# EAGLE design SKAARDUINO_v3.1_back (EAGLE 7.5.0)

## Sheet 1 of 2
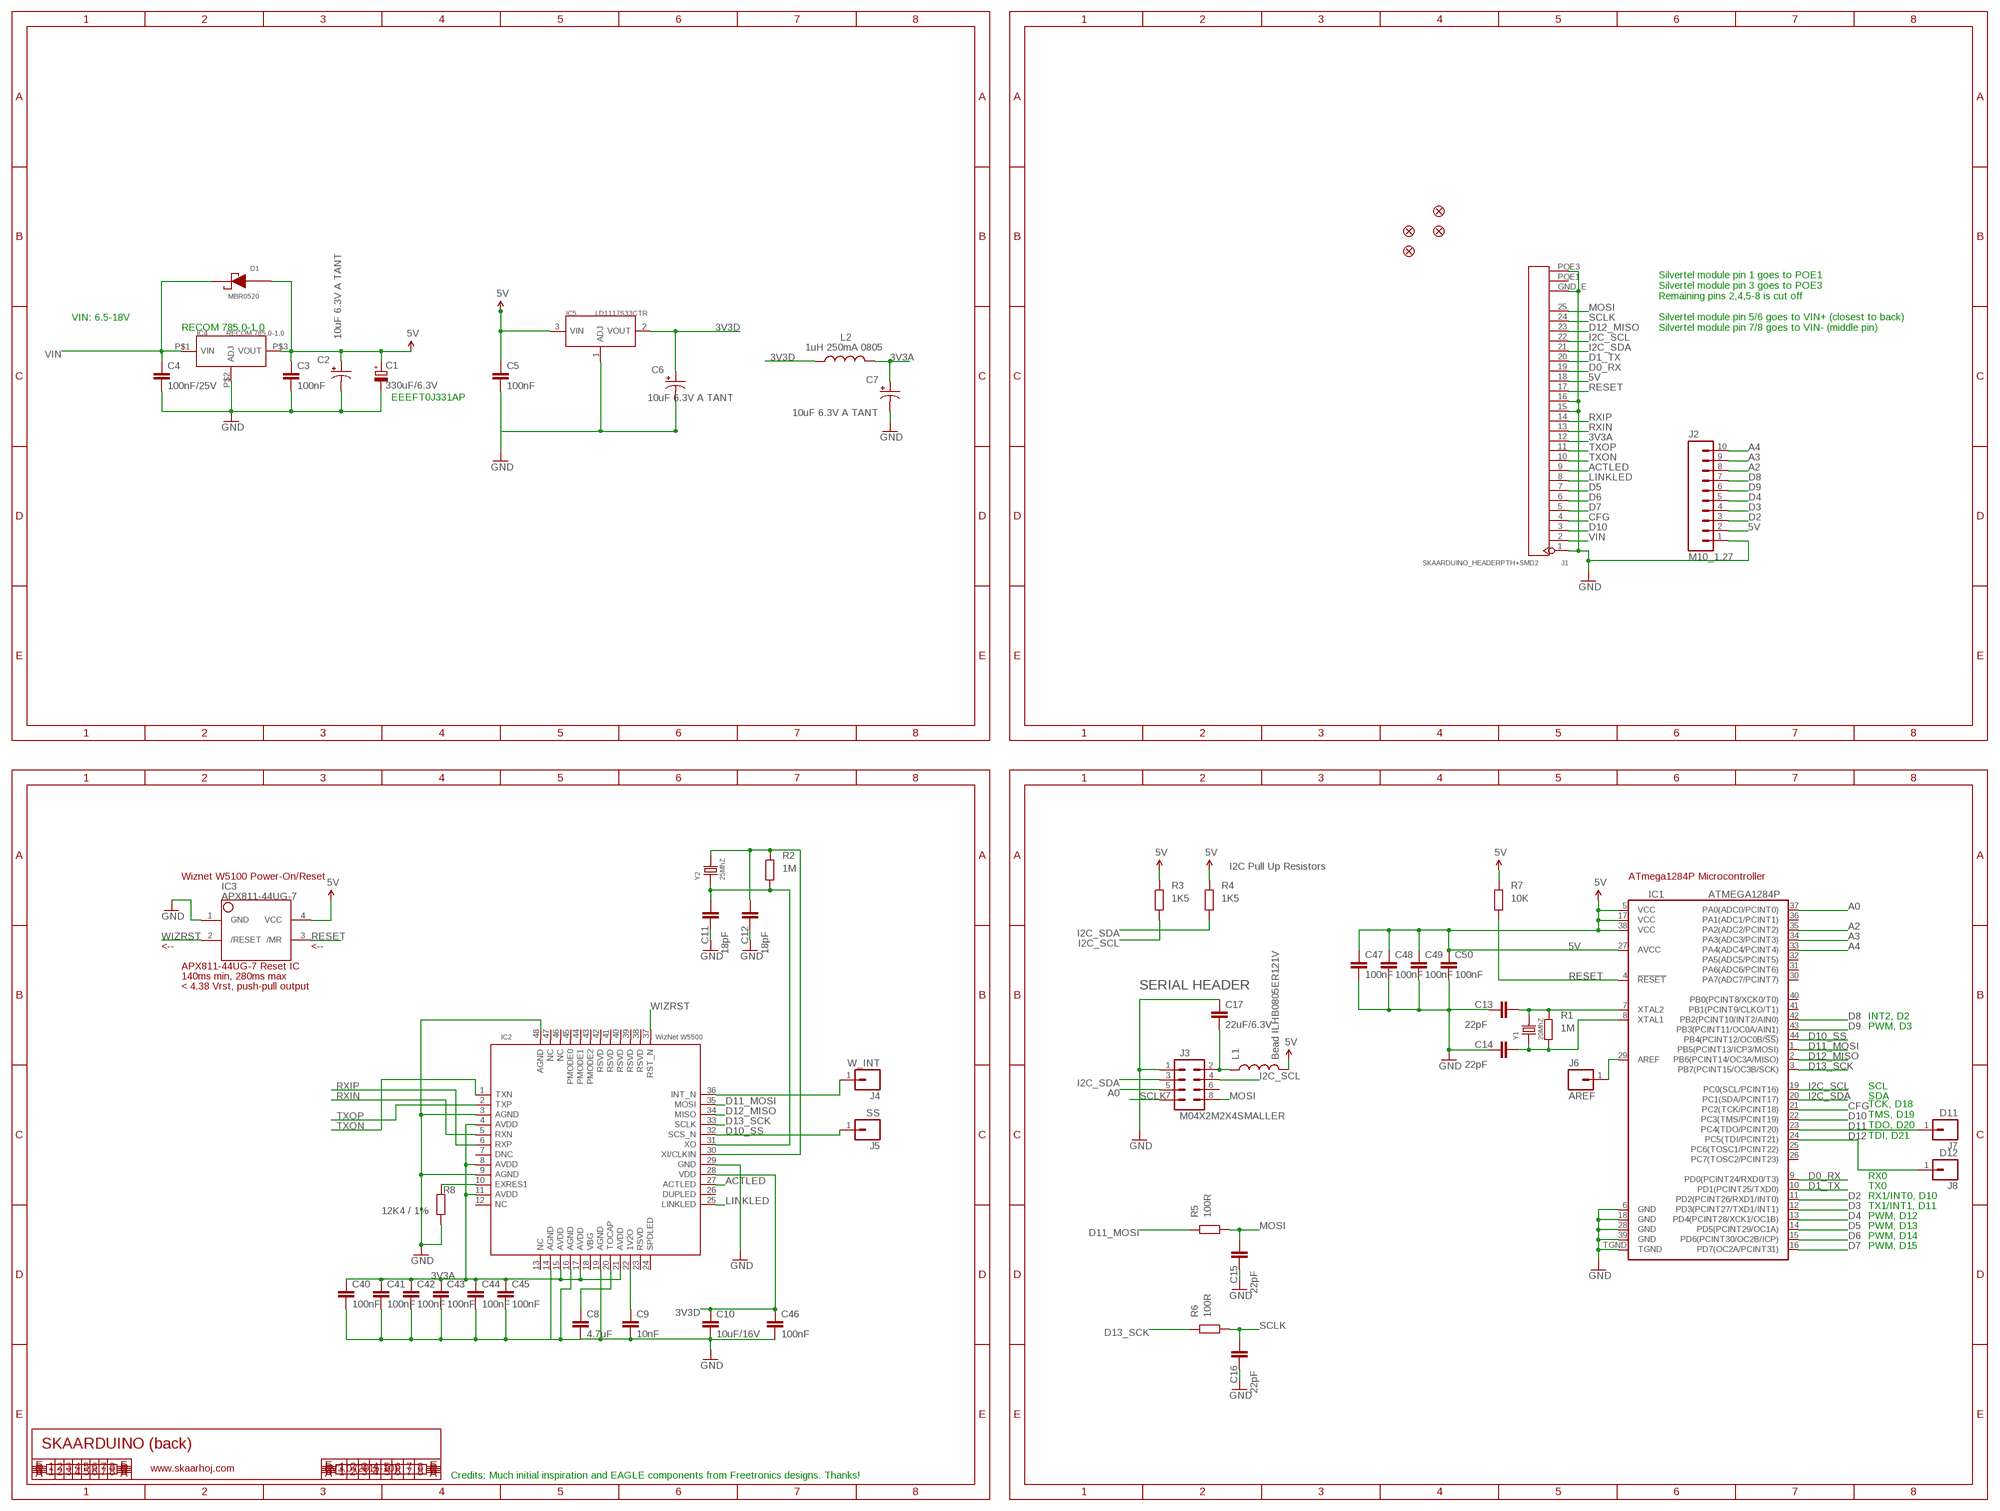
[diagram p0: schematic, sheet 1]

### Parts
C1  330uF/6.3V  CPOL-EUD  [PANASONIC_D]
C2  10uF 6.3V A TANT  CAP_POL1206  [EIA3216]
C3  100nF  C-EU0402C  [0402C]
C4  100nF/25V  C-EU0402C  [0402C]
C5  100nF  C-EU0402C  [0402C]
C6  10uF 6.3V A TANT  CAP_POL1206  [EIA3216]
C7  10uF 6.3V A TANT  CAP_POL1206  [EIA3216]
C8  4.7uF  CAP0805  [0805]
C9  10nF  C-EU0402C  [0402C]
C10  10uF/16V  CAP0805  [0805]
C11  18pF  C-EU0402C  [0402C]
C12  18pF  C-EU0402C  [0402C]
C13  22pF  C-EU0402C  [0402C]
C14  22pF  C-EU0402C  [0402C]
C15  22pF  C-EU0402C  [0402C]
C16  22pF  C-EU0402C  [0402C]
C17  22uF/6.3V  CAP0805  [0805]
C40  100nF  C-EU0402C  [0402C]
C41  100nF  C-EU0402C  [0402C]
C42  100nF  C-EU0402C  [0402C]
C43  100nF  C-EU0402C  [0402C]
C44  100nF  C-EU0402C  [0402C]
C45  100nF  C-EU0402C  [0402C]
C46  100nF  C-EU0402C  [0402C]
C47  100nF  C-EU0402C  [0402C]
C48  100nF  C-EU0402C  [0402C]
C49  100nF  C-EU0402C  [0402C]
C50  100nF  C-EU0402C  [0402C]
D1  MBR0520  [SOD-123]
FID1  FIDUCIAL1X2.5  [FIDUCIAL-1X2.5]
FID2  FIDUCIAL1X2.5  [FIDUCIAL-1X2.5]
FID3  FIDUCIAL1X2.5  [FIDUCIAL-1X2.5]
FID4  FIDUCIAL1X2.5  [FIDUCIAL-1X2.5]
IC1  ATMEGA1284P  [QFN-44M1]
IC2  WizNet W5500  DRIVER-W5500  [LQFP-48]
IC3  APX811-44UG-7  APX81X-RESET-IC  [SOT143-R]
IC4  RECOM 785.0-1.0  PMIC-LM317EMP  [RECOM_785.0-1.0]
IC5  LD1117S33CTR  PMIC-LM317EMPUPRIGHT  [SOT-223-UPRIGHT]
J1  SKAARDUINO_HEADERPTH+SMD2  [SKAARDUINO_PTH_SMD2_HEADER]
J2  M10_1.27  [M10X1]
J3  M04X2M2X4SMALLER  [M2X4SMALLER]
J4  W_INT  M1X1TEST  [M1X1]
J5  SS  M1X1TEST  [M1X1]
J6  AREF  M1X1TEST  [M1X1]
J7  D11  M1X1TEST  [M1X1]
J8  D12  M1X1TEST  [M1X1]
L1  Bead ILHB0805ER121V  INDUCTOR0805  [0805]
L2  1uH 250mA 0805  L-USL2012C  [L2012C]
R1  1M  RESISTOR0402  [0402]
R2  1M  RESISTOR0402  [0402]
R3  1K5  RESISTOR0402  [0402]
R4  1K5  RESISTOR0402  [0402]
R5  100R  RESISTOR0402  [0402]
R6  100R  RESISTOR0402  [0402]
R7  10K  RESISTOR0402  [0402]
R8  12K4 / 1%  RESISTOR0402  [0402]
Y1  20MhZ  SMD-CRYSTAL-16MHZ-8PF-20PPM-40R(2P-5.0X3.2MM)  [X2-SMD-5.0X3.2X1.3MM]
Y2  25MhZ  SMD-CRYSTAL-16MHZ-8PF-20PPM-40R(2P-5.0X3.2MM)  [X2-SMD-5.0X3.2X1.3MM]

### Nets
3V3A [power]: C7.A(+) C40.1 C41.1 C42.1 C43.1 C44.1 C45.1 IC2.4(AVDD) IC2.8(AVDD) IC2.11(AVDD) IC2.15(AVDD) IC2.17(AVDD) IC2.21(AVDD) J1.12 L2.2
3V3D [power]: C6.A(+) C10.1 C46.1 IC2.28(VDD) IC5.2(VOUT) L2.1
5V [power]: C1.+ C2.A(+) C3.1 C5.1 C47.1 C48.1 C49.1 C50.1 D1.2(AN) IC1.5(VCC) IC1.17(VCC) IC1.27(AVCC) IC1.38(VCC) IC3.4(VCC) IC4.P$3(VOUT) IC5.3(VIN) J1.18 J2.2 L1.2 R3.2 R4.2 R7.2
A0: IC1.37(PA0(ADC0/PCINT0)) J3.5
A2: IC1.35(PA2(ADC2/PCINT2)) J2.8
A3: IC1.34(PA3(ADC3/PCINT3)) J2.9
A4: IC1.33(PA4(ADC4/PCINT4)) J2.10
ACTLED: IC2.27(ACTLED) J1.9
CFG: IC1.21(PC2(TCK/PCINT18)) J1.4
D0_RX: IC1.9(PD0(PCINT24/RXD0/T3)) J1.19
D1_TX: IC1.10(PD1(PCINT25/TXD0)) J1.20
D2: IC1.11(PD2(PCINT26/RXD1/INT0)) J2.3
D3: IC1.12(PD3(PCINT27/TXD1/INT1)) J2.4
D4: IC1.13(PD4(PCINT28/XCK1/OC1B)) J2.5
D5: IC1.14(PD5(PCINT29/OC1A)) J1.7
D6: IC1.15(PD6(PCINT30/OC2B/ICP)) J1.6
D7: IC1.16(PD7(OC2A/PCINT31)) J1.5
D8: IC1.42(PB2(PCINT10/INT2/AIN0)) J2.7
D9: IC1.43(PB3(PCINT11/OC0A/AIN1)) J2.6
D10: IC1.22(PC3(TMS/PCINT19)) J1.3
D10_SS: IC1.44(PB4(PCINT12/OC0B/!SS!)) IC2.32(SCS_N) J5.1
D11: IC1.23(PC4(TDO/PCINT20)) J7.1
D11_MOSI: IC1.1(PB5(PCINT13/ICP3/MOSI)) IC2.35(MOSI) R5.2
D12: IC1.24(PC5(TDI/PCINT21)) J8.1
D12_MISO: IC1.2(PB6(PCINT14/OC3A/MISO)) IC2.34(MISO) J1.23
D13_SCK: IC1.3(PB7(PCINT15/OC3B/SCK)) IC2.33(SCLK) R6.2
GND [power]: C1.- C2.C(-) C3.2 C4.2 C5.2 C6.C(-) C7.C(-) C8.2 C9.2 C10.2 C11.1 C12.1 C13.1 C14.1 C15.1 C16.1 C17.1 C40.2 C41.2 C42.2 C43.2 C44.2 C45.2 C46.2 C47.2 C48.2 C49.2 C50.2 IC1.6(GND) IC1.18(GND) IC1.28(GND) IC1.39(GND) IC1.TGND IC2.3(AGND) IC2.9(AGND) IC2.14(AGND) IC2.16(AGND) IC2.19(AGND) IC2.29(GND) IC2.48(AGND) IC3.1(GND) IC4.P$2(ADJ) IC5.1(ADJ) J1.1 J1.15 J1.16 J1.GND_E J1.POE3 J2.1 J3.1 R8.1
I2C_SCL: IC1.19(PC0(SCL/PCINT16)) J1.22 J3.4 R3.1
I2C_SDA: IC1.20(PC1(SDA/PCINT17)) J1.21 J3.3 R4.1
LINKLED: IC2.25(LINKLED) J1.8
MOSI: C15.2 J1.25 J3.8 R5.1
N$2 [power]: C17.2 J3.2 L1.1
N$3: IC2.36(INT_N) J4.1
N$4: C14.2 IC1.8(XTAL1) R1.1 Y1.1
N$5: C13.2 IC1.7(XTAL2) R1.2 Y1.2
N$8: IC1.29(AREF) J6.1
N$13: C8.1 IC2.20(TOCAP)
N$18: C9.1 IC2.22(1V2O)
N$19: IC2.10(EXRES1) R8.2
RESET: IC1.4(!RESET) IC3.3(/MR) J1.17 R7.1
RXIN: IC2.5(RXN) J1.13
RXIP: IC2.6(RXP) J1.14
SCLK: C16.2 J1.24 J3.7 R6.1
TXON: IC2.1(TXN) J1.10
TXOP: IC2.2(TXP) J1.11
VIN [VIN]: C4.1 D1.1(CA) IC4.P$1(VIN) J1.2
WIZRST: IC2.37(RST_N) IC3.2(/RESET)
XTLN: C12.2 IC2.30(XI/CLKIN) R2.2 Y2.2
XTLP: C11.2 IC2.31(XO) R2.1 Y2.1
Unconnected: IC1.25(PC6(TOSC1/PCINT22)) IC1.26(PC7(TOSC2/PCINT23)) IC1.30(PA7(ADC7/PCINT7)) IC1.31(PA6(ADC6/PCINT6)) IC1.32(PA5(ADC5/PCINT5)) IC1.36(PA1(ADC1/PCINT1)) IC1.40(PB0(PCINT8/XCK0/T0)) IC1.41(PB1(PCINT9/CLKO/T1)) IC2.7(DNC) IC2.12(NC) IC2.13(NC) IC2.18(VBG) IC2.23(RSVD) IC2.24(SPDLED) IC2.26(DUPLED) IC2.38(RSVD) IC2.39(RSVD) IC2.40(RSVD) IC2.41(RSVD) IC2.42(RSVD) IC2.43(PMODE2) IC2.44(PMODE1) IC2.45(PMODE0) IC2.46(NC) IC2.47(NC) J1.POE1 J3.6

### Notes on the sheet
- VIN: 6.5-18V
- RECOM 785.0-1.0
- Silvertel module pin 1 goes to POE1
  Silvertel module pin 3 goes to POE3
  Remaining pins 2,4,5-8 is cut off
  
  Silvertel module pin 5/6 goes to VIN+ (closest to back)
  Silvertel module pin 7/8 goes to VIN- (middle pin)
- EEEFT0J331AP
- I2C Pull Up Resistors
- Wiznet W5100 Power-On/Reset | ATmega1284P Microcontroller
- <-- | <--
- APX811-44UG-7 Reset IC
- 140ms min, 280ms max
- < 4.38 Vrst, push-pull output | SERIAL HEADER
- INT2, D2
- PWM, D3
- SCL
- SDA
- TCK, D18
  TMS, D19
  TDO, D20
  TDI, D21
- RX0
- TX0
- RX1/INT0, D10
- TX1/INT1, D11
- PWM, D12
- PWM, D13
- PWM, D14
- PWM, D15
- SKAARDUINO (back)
- www.skaarhoj.com | V3.0 (2015-10)
- Credits: Much initial inspiration and EAGLE components from Freetronics designs. Thanks!

## Sheet 2 of 2

## Library data of the parts
C1 = rcl:CPOL-EU: POLARIZED CAPACITOR, European symbol
C2 C6 C7 = freetronics:CAP_POL: Capacitor Polarized These are standard SMD and PTH capacitors. Normally 10uF, 47uF, and 100uF in electrolytic and tantalum varieties. Always verify the external diameter of the through hole cap, it varies with capacity, voltage, and manufacturer. The EIA devices should be standard.
C3-C5 C9 C11-C16 C40-C50 = freetronics-jon:C-EU: CAPACITOR, European symbol
C8 C10 C17 = SparkFun:CAP: Capacitor Standard 0603 ceramic capacitor, and 0.1" leaded capacitor.
D1 = MySMD:MBR0520
FID1-FID4 = freetronics:FIDUCIAL: Fiducial Alignment Points Various fiducial points for machine vision alignment.
IC1 = freetronics-jon:ATMEGA1284P
IC2 = template:DRIVER-W5500
IC3 = freetronics-master-v1:APX81X-RESET-IC
IC4 IC5 = SKAARHOJ:PMIC-LM317EMP: 3-Terminal Adjustable Regulator
J1 = SKAARHOJ:SKAARDUINO_HEADER
J2 = SKAARHOJ:M10_1.27
J3 = SKAARHOJ:M04X2
J4-J8 = SKAARHOJ:M1X1
L1 = SparkFun:INDUCTOR: Inductors Basic Inductor/Choke - 0603 and 1206. Footprints are not proven and vary greatly between part numbers.
L2 = rcl:L-US: INDUCTOR, American symbol
R1-R8 = freetronics-jon:RESISTOR: Resistor Basic schematic elements and footprints for 0603, 1206, and PTH 1/10th watt (small) resistors.
Y1 Y2 = Seeed-OPL-crystal-osctllator:SMD-CRYSTAL-16MHZ-8PF-20PPM-40R(2P-5.0X3.2MM): 306010054; MPN: X053201602002

## Net classes
0 default: width 0.203 mm, clearance 0.152 mm
1 power: width 0.203 mm, clearance 0.152 mm
2 VIN: width 0.406 mm, clearance 0.356 mm

## Board
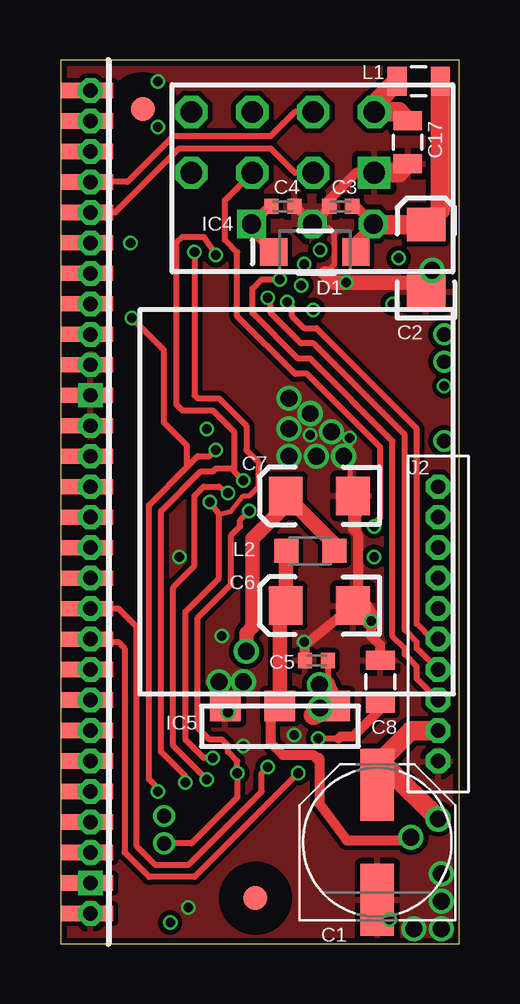
[diagram p1: board, top side]
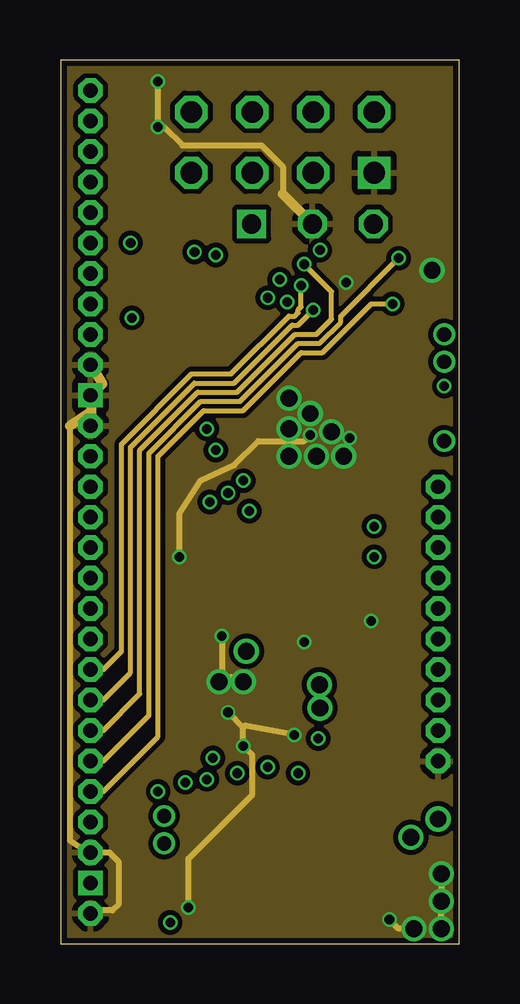
[diagram p2: board, inner layer GND]
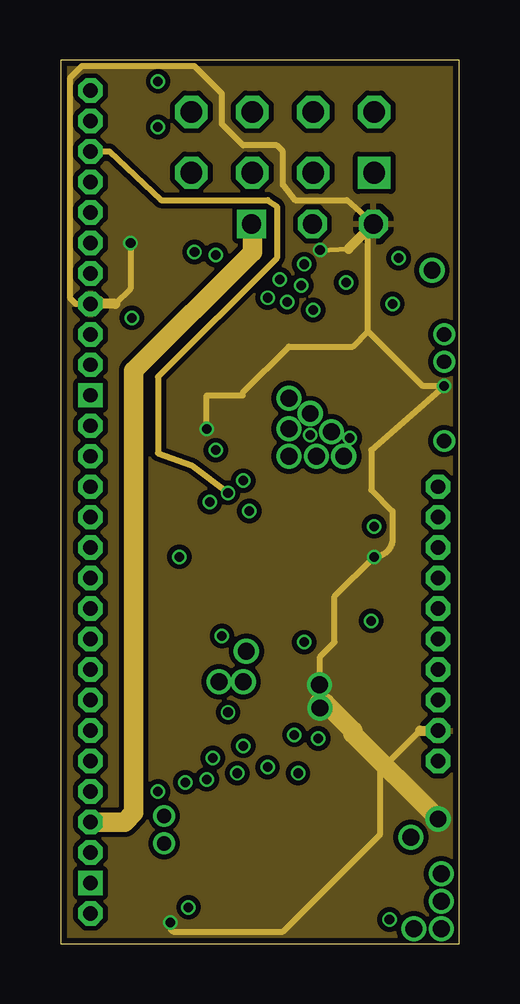
[diagram p3: board, inner layer 5V]
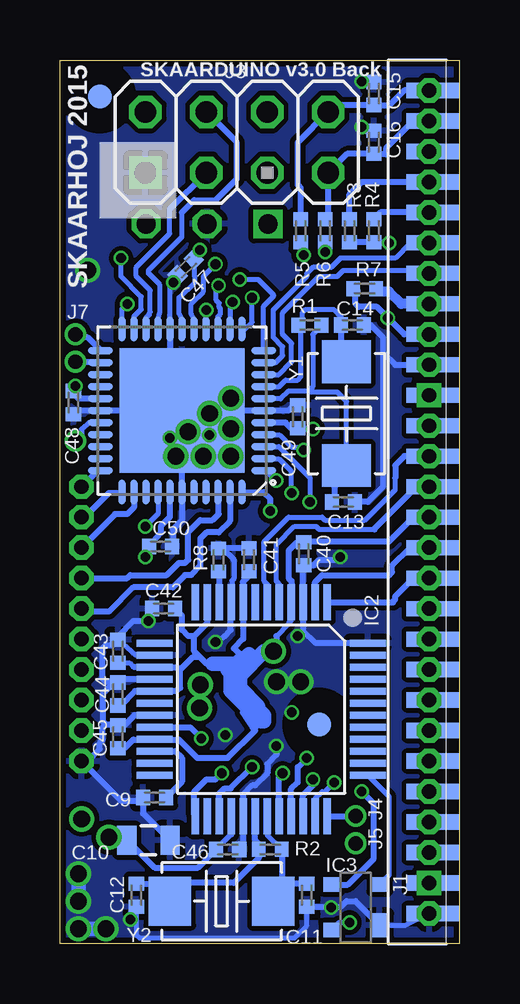
[diagram p4: board, bottom side, seen from below]

Size 16.64 x 36.83 mm. Coordinates in mm from the lower left corner, seen from the top.
Outline: 0,0 16.64,0 16.64,36.83 0,36.83 0,0
Copper layers (1*2*15*16): Top 0.035mm / dielectric 0.2mm / GND 0.0175mm / dielectric 0.3mm / 5V 0.0175mm / dielectric 0.2mm / Bottom 0.035mm
Design rules "SeeedStudio_4layer_DRU_no_angle_20140221 *": minimum track width 8mil, minimum drill 12mil, track to track 8mil, track to pad 8mil, pad to pad 8mil, via to via 8mil, smd to smd 0mil, copper to edge 10mil, drill to drill 8mil, minimum pad ring 6mil, minimum via ring 4mil, stop-mask expansion 4mil, vias tented up to drill 100mil, thermal gap 10mil
tKeepout: area 0,0 to 3.3,36.8
tRestrict: area 2.4,33.8 to 4.4,35.8; area 7.1,0.9 to 9.1,2.9
bRestrict: area 4.8,8.1 to 6.9,10.2; area 14,34.3 to 16,36.3

### Footprints (pad centres in the part's own frame; a part is rotated, then mirrored left to right if it is on the bottom)
PANASONIC_D = smd 3 x 1.4: + 2.4,0; - -2.4,0
EIA3216 = smd 1.4 x 1.6: A 1.4,0; C -1.4,0
0402C = smd 0.59 x 0.64: 1 -0.48,0; 2 0.48,0
0805 = smd 0.8 x 1.2: 1 -0.9,0; 2 0.9,0
SOD-123 = smd 1.143 x 1.143: 1 0,0; 2 3.429,0
FIDUCIAL-1X2.5 = smd 1 x 1: 1 0,0
QFN-44M1 = smd 0.3 x 1.05: 1 -2.5,-3.4; 2 -2,-3.4; 3 -1.5,-3.4; 4 -1,-3.4; 5 -0.5,-3.4; 6 0,-3.4; 7 0.5,-3.4; 8 1,-3.4; 9 1.5,-3.4; 10 2,-3.4; 11 2.5,-3.4; 23 2.5,3.4; 24 2,3.4; 25 1.5,3.4; 26 1,3.4; 27 0.5,3.4; 28 0,3.4; 29 -0.5,3.4; 30 -1,3.4; 31 -1.5,3.4; 32 -2,3.4; 33 -2.5,3.4 | smd 1.05 x 0.3: 12 3.4,-2.5; 13 3.4,-2; 14 3.4,-1.5; 15 3.4,-1; 16 3.4,-0.5; 17 3.4,0; 18 3.4,0.5; 19 3.4,1; 20 3.4,1.5; 21 3.4,2; 22 3.4,2.5; 34 -3.4,2.5; 35 -3.4,2; 36 -3.4,1.5; 37 -3.4,1; 38 -3.4,0.5; 39 -3.4,0; 40 -3.4,-0.5; 41 -3.4,-1; 42 -3.4,-1.5; 43 -3.4,-2; 44 -3.4,-2.5 | smd 5.2 x 5.2: TGND 0,0
LQFP-48 = smd 1.5 x 0.3: 1 -4.45,2.75; 2 -4.45,2.25; 3 -4.45,1.75; 4 -4.45,1.25; 5 -4.45,0.75; 6 -4.45,0.25; 7 -4.45,-0.25; 8 -4.45,-0.75; 9 -4.45,-1.25; 10 -4.45,-1.75; 11 -4.45,-2.25; 12 -4.45,-2.75; 25 4.45,-2.75; 26 4.45,-2.25; 27 4.45,-1.75; 28 4.45,-1.25; 29 4.45,-0.75; 30 4.45,-0.25; 31 4.45,0.25; 32 4.45,0.75; 33 4.45,1.25; 34 4.45,1.75; 35 4.45,2.25; 36 4.45,2.75 | smd 0.3 x 1.5: 13 -2.75,-4.45; 14 -2.25,-4.45; 15 -1.75,-4.45; 16 -1.25,-4.45; 17 -0.75,-4.45; 18 -0.25,-4.45; 19 0.25,-4.45; 20 0.75,-4.45; 21 1.25,-4.45; 22 1.75,-4.45; 23 2.25,-4.45; 24 2.75,-4.45; 37 2.75,4.45; 38 2.25,4.45; 39 1.75,4.45; 40 1.25,4.45; 41 0.75,4.45; 42 0.25,4.45; 43 -0.25,4.45; 44 -0.75,4.45; 45 -1.25,4.45; 46 -1.75,4.45; 47 -2.25,4.45; 48 -2.75,4.45
SOT143-R = smd 1 x 0.7: 1 -0.75,-1 | smd 0.6 x 0.7: 2 0.95,-1; 3 0.95,1; 4 -0.95,1
RECOM_785.0-1.0 = drill 0.8 square: P$1 -2.54,0 | drill 0.8 octagon: P$2 0,0; P$3 2.54,0
SOT-223-UPRIGHT = smd 1.27 x 1.27: 1 -2.286,0; 2 0,0; 3 2.286,0
SKAARDUINO_PTH_SMD2_HEADER = drill 0.6 pad 1.016 octagon: 1 -1.25,3.81; 2 -1.25,5.08; 3 -1.25,6.35; 4 -1.25,7.62; 5 -1.25,8.89; 6 -1.25,10.16; 7 -1.25,11.43; 8 -1.25,12.7; 9 -1.25,13.97; 10 -1.25,15.24; 11 -1.25,16.51; 12 -1.25,17.78; 13 -1.25,19.05; 14 -1.25,20.32; 15 -1.25,21.59; 16 -1.25,24.13; 17 -1.25,25.4; 18 -1.25,26.67; 19 -1.25,27.94; 20 -1.25,29.21; 21 -1.25,30.48; 22 -1.25,31.75; 23 -1.25,33.02; 24 -1.25,34.29; 25 -1.25,35.56; GND_E -1.25,1.27 | smd 2.2 x 0.635 bottom: P$1 -1.1,5.08; P$2 -1.1,6.35; P$4 -1.1,2.54; P$5 -1.1,1.27; P$6 -1.1,7.62; P$7 -1.1,8.89; P$8 -1.1,10.16; P$9 -1.1,11.43; P$10 -1.1,12.7; P$11 -1.1,13.97; P$12 -1.1,15.24; P$13 -1.1,16.51; P$14 -1.1,17.78; P$15 -1.1,19.05; P$16 -1.1,20.32; P$17 -1.1,21.59; P$18 -1.1,22.86; P$19 -1.1,24.13; P$20 -1.1,25.4; P$21 -1.1,26.67; P$22 -1.1,27.94; P$23 -1.1,29.21; P$24 -1.1,30.48; P$25 -1.1,31.75; P$26 -1.1,33.02; P$27 -1.1,34.29; P$28 -1.1,35.56; P$54 -1.1,3.81 | smd 2.2 x 0.635: P$3 -1.1,3.81; P$29 -1.1,2.54; P$30 -1.1,1.27; P$31 -1.1,5.08; P$32 -1.1,6.35; P$33 -1.1,7.62; P$34 -1.1,8.89; P$35 -1.1,10.16; P$36 -1.1,11.43; P$37 -1.1,12.7; P$38 -1.1,13.97; P$39 -1.1,15.24; P$40 -1.1,16.51; P$41 -1.1,17.78; P$42 -1.1,19.05; P$43 -1.1,20.32; P$44 -1.1,21.59; P$45 -1.1,22.86; P$46 -1.1,24.13; P$47 -1.1,25.4; P$48 -1.1,26.67; P$49 -1.1,27.94; P$50 -1.1,29.21; P$51 -1.1,30.48; P$52 -1.1,31.75; P$53 -1.1,33.02; P$55 -1.1,34.29; P$56 -1.1,35.56 | drill 0.6 pad 1.016 square: POE1 -1.25,2.54; POE3 -1.25,22.86
M10X1 = drill 0.6 pad 1.016 octagon: 1 0,0; 2 0,1.27; 3 0,2.54; 4 0,3.81; 5 0,5.08; 6 0,6.35; 7 0,7.62; 8 0,8.89; 9 0,10.16; 10 0,11.43
M2X4SMALLER = drill 0.9 square: 1 -1.27,3.81 | drill 0.9 octagon: 2 1.27,3.81; 3 -1.27,1.27; 4 1.27,1.27; 5 -1.27,-1.27; 6 1.27,-1.27; 7 -1.27,-3.81; 8 1.27,-3.81
M1X1 = drill 0.6 pad 0.813: 1 0,0
L2012C = smd 1 x 1: 1 -1,0; 2 1,0
0402 = smd 0.571 x 0.62: 1 -0.48,0; 2 0.48,0
X2-SMD-5.0X3.2X1.3MM = smd 1.778 x 2.032: 1 -2.159,0; 2 2.159,0

### Placement (x,y rotation side)
C1  13.21,4.24 90 top
C2  15.24,28.57 90 top
C3  11.68,30.73 180 top
C4  9.27,30.73 0 top
C5  10.67,11.81 180 top
C6  10.79,14.1 180 top
C7  10.79,18.67 180 top
C8  13.34,10.92 90 top
C9  12.7,6.1 180 bottom
C10  12.95,4.32 0 bottom
C11  6.35,2.03 90 bottom
C12  13.46,2.03 90 bottom
C13  4.83,18.41 180 bottom
C14  4.45,25.78 180 bottom
C15  3.56,35.43 270 bottom
C16  3.56,33.4 270 bottom
C17  14.48,33.4 90 top
C40  6.48,16.26 270 bottom
C41  8.76,16 90 bottom
C42  12.32,13.97 180 bottom
C43  14.22,12.19 90 bottom
C44  14.22,10.41 90 bottom
C45  14.22,8.64 90 bottom
C46  9.65,3.94 0 bottom
C47  11.4,28.19 225 bottom
C48  16.08,22.56 270 bottom
C49  6.73,21.97 90 bottom
C50  12.45,16.56 0 bottom
D1  8.89,28.83 0 top
FID1  8.13,1.91 0 top
FID2  3.43,34.8 0 top
FID3  14.99,35.31 0 bottom
FID4  5.84,9.14 0 bottom
IC1  11.56,22.23 90 bottom
IC2  8.26,9.78 270 bottom
IC3  4.32,1.52 90 bottom
IC4  10.51,30 0 top
IC5  9.15,9.91 0 top
J1  0,0 0 bottom
J2  15.75,7.62 0 top
J3  9.27,33.4 90 bottom
J4  4.32,5.33 0 top
J5  4.32,4.19 0 bottom
J6  16,20.95 0 top
J7  16,25.4 0 top
J8  16,24.26 0 top
L1  14.94,35.94 0 top
L2  10.41,16.38 0 top
R1  6.22,25.78 0 bottom
R2  7.87,3.94 180 bottom
R3  4.57,29.72 270 bottom
R4  3.56,29.72 270 bottom
R5  6.6,29.72 270 bottom
R6  5.59,29.72 270 bottom
R7  3.94,27.3 0 bottom
R8  10.03,16 270 bottom
Y1  4.7,22.1 270 bottom
Y2  9.91,1.78 180 bottom

### Tracks (layer width: path | path; a pad name or v marks a point on that pad's centre or on a via)
3V3A  (via drill 0.7)
  Top 0.203: 9.14,18.29 9.27,18.16
  Top 0.61: 11.41,16.4 L2.2 11.41,16.65 C7.A 9.27,18.55 9.27,18.16 8,16.89 8,13.21 7.75,12.95 v7.75,12.19 | 9.53,18.29 9.14,18.29
  Bottom 0.203: C43.1 13.74,11.71 13.59,11.56 | 7.62,12.83 7.11,13.34 7.11,13.36 7.01,13.46 IC2.4
  Bottom 0.254: IC2.4 6.99,14.25 6.99,15.11 7.11,15.24 7.11,16.38 6.76,16.74 C40.1 6.45,16.76 2.92,16.76 1.91,17.78 J1.12 | C41.1 8.76,15.34 9.02,15.09 IC2.8 9.01,12.71 9.4,12.32 9.14,12.06 8.76,12.06 | 10.54,14.19 IC2.11 10.51,13.37 11.05,12.83 | 11.05,12.83 11.3,12.83 11.56,13.08 11.56,13.69 C42.1 | 13.59,11.56 12.73,11.56 IC2.15 11.78,11.53 11.63,11.43 | C44.1 14.12,9.93 13.51,10.54 12.72,10.54 | 12.72,10.54 IC2.17 | C45.1 13.94,8.16 13.59,8.51 12.72,8.51 | 12.72,8.51 IC2.21 | 12.72,8.51 11.68,8.51 10.92,7.75 9.65,7.75 8.51,8.89 | 8.51,8.89 9.02,9.65 | 7.62,12.83 7.62,12.32 v7.75,12.19 | 12.72,10.54 11.81,10.54 11.63,10.67 11.63,11.43 | 10.79,11.94 11.05,12.19 11.05,12.83 | 10.29,11.68 10.54,11.68 10.79,11.94 | 10.79,11.94 11.12,11.94 11.63,11.43 | 8.51,8.89 8.51,9.02 8.26,9.27
  Bottom 0.61: v7.75,12.19 8.13,12.19 9.14,11.18 9.14,10.67 8.38,9.91 8.38,9.78 8.13,9.53 8.13,9.27 8.26,9.27 9.53,10.54 9.53,11.3 9.65,11.43 9.53,11.43 9.27,11.68 | 10.29,11.68 9.27,11.68 | 9.27,11.68 9.14,11.81 9.02,11.81 8.76,12.06
3V3D  (via drill 0.7)
  Top 0.406: IC5.2 8.76,9.53 8.76,8.38 9.27,7.87 10.54,7.87 10.79,7.62 | 10.79,7.75 10.79,7.62 | 10.79,7.62 10.79,5.84 11.94,4.32 14.48,4.32 v14.61,4.45
  Top 0.61: IC5.2 9.15,13.85 C6.A 9.39,16.36 L2.1
  Top 0.813: 9.15,13.96 C6.A
  Bottom 0.203: 9.51,4.56 C46.1
  Bottom 0.254: IC2.28 9.51,4.56 | C10.1 12.7,3.17 10.89,3.17 C46.1
  Bottom 0.406: v14.61,4.45 13.98,4.45 C10.1
5V  (via drill 0.4, 0.7)
  Top 0.254: IC5.3 11.15,10.7 C5.1 11.15,10.51 v10.82,9.83
  Top 0.406: C3.1 12.32,30.73 IC4.P$3 12.32,29.27 D1.2
  Top 0.813: L1.2 15.84,30.57 C2.A 13.07,29.98 IC4.P$3 | C1.+ 13,7.29 | 13,7.29 14.61,8.89 J2.2 | 10.54,9.52 IC5.3 11.06,10.79 v10.79,10.79 | 13,7.29 13.67,7.29 v15.75,5.21
  5V 0.203: v10.82,28.91 12.01,28.96
  5V 0.254: v2.92,29.21 2.92,27.3 2.29,26.67 | 1.62,26.8 J1.18 0.64,26.67 0.38,26.92 0.38,36.07 0.89,36.58 5.59,36.58 6.73,35.43 6.73,34.16 7.62,33.27 9.02,33.27 9.27,33.02 9.27,31.62 9.78,30.99 11.94,30.99 IC4.P$3 12.83,29.78 12.83,25.53 | v6.1,21.46 6.1,22.86 7.59,22.86 7.59,22.96 9.53,24.89 12.19,24.89 12.83,25.53 | v4.57,0.89 4.57,0.64 4.7,0.51 9.27,0.51 13.34,4.57 13.34,7.24 14.99,8.89 | v10.82,9.83 10.82,11.96 11.43,12.57 11.43,14.48 v13.08,16.13 arc90 13.84,16.89 13.84,18.03 12.95,18.92 12.95,20.57 v16,23.24 15.11,23.24 12.83,25.53
  5V 0.406: 2.29,26.67 J1.18 | 1.02,26.8 1.62,26.8 | 14.99,8.89 J2.2 | 12.01,28.96 IC4.P$3
  5V 0.813: v15.75,5.21 12.19,8.76 12.19,8.89 11.05,10.03 10.77,10.03 v10.82,9.83
  Bottom 0.203: 5.32,0.78 IC3.4 5,0.89 v4.57,0.89 | C50.1 12.93,16.28 v13.08,16.13 | IC1.17 11.56,26.04 11.68,26.26 11.68,26.92 11.04,27.54 C47.1 11.06,28.69 v10.82,28.91
  Bottom 0.254: IC1.5 7.89,21.72 7.24,21.72 7.01,21.49 C49.1 6.12,21.49 v6.1,21.46 | IC1.38 12.06,18.82 12.06,17.78 12.45,17.4 12.45,17.12 C50.1 | C48.1 15.74,22.73 IC1.27 15.87,22.73 16.13,22.99 16.13,23.11 v16,23.24 | R3.2 R4.2 2.95,29.24 v2.92,29.21
  Bottom 0.406: J1.18 2.41,26.67 2.92,27.18 3.33,27.18 R7.2
  pour 5V: 0,0 17.14,0 17.14,36.83 0,36.83
A0  (via drill 0.4)
  Top 0.254: J3.5 6.86,30.99 6.86,29.34 7.37,28.83 7.37,26.16 9.78,23.75 10.29,23.75 13.34,20.7 13.34,17.78 13.08,17.53 v13.08,17.4
  Bottom 0.203: IC1.37 12.56,17.92 v13.08,17.4
A2
  Bottom 0.254: IC1.35 13.56,18.19 13.84,17.91 14.35,17.91 J2.8
A3
  Bottom 0.254: J2.9 15.62,17.78 14.61,18.8 14.09,18.8 IC1.34
A4
  Bottom 0.254: IC1.33 15.07,19.73 J2.10
ACTLED  (via drill 0.4)
  Top 0.254: v8.64,7.37 8.38,7.11 8.38,6.35 5.33,3.3 3.94,3.3 3.17,4.06 3.17,13.21 2.41,13.97 J1.9
  Bottom 0.254: IC2.27 10.01,6.25 9.78,6.48 9.53,6.48 v8.64,7.37
CFG  (via drill 0.4)
  GND 0.203: J1.4 1.78,7.62 3.68,9.53 3.68,20.45 5.84,22.61 7.49,22.61 9.91,25.02 10.79,25.02 11.68,25.91 11.68,26.16 v14.1,28.57
  Bottom 0.203: IC1.21 13.56,26.14 13.26,26.44 13.26,26.98 14.1,27.81 v14.1,28.57
D0_RX
  Bottom 0.203: IC1.9 7.52,23.73 6.99,24.26 6.99,25.02 7.37,25.4 7.37,26.29 5.84,27.81 5.08,27.81 4.83,28.07 1.88,28.07 J1.19
D1_TX
  Bottom 0.203: IC1.10 7.65,24.23 7.37,24.51 7.37,24.89 7.75,25.27 7.75,26.42 6.35,27.81 6.35,27.94 6.1,28.19 5.33,28.19 4.95,28.57 2.67,28.57 2.03,29.21 J1.20
D2  (via drill 0.4)
  Top 0.254: J2.3 14.86,11.05 14.86,11.56 14.35,12.06 14.35,12.32 13.84,12.83 13.84,20.95 10.41,24.38 9.91,24.38 8,26.29 8,27.3 8.38,27.69 v9.14,27.69
  Bottom 0.203: IC1.11 8.16,26.57 7.75,26.98 7.75,27.05 8.38,27.69 v9.14,27.69
D3  (via drill 0.4)
  Top 0.254: J2.4 14.86,12.32 14.86,12.57 14.35,13.08 14.35,21.21 10.54,25.02 10.03,25.02 8.76,26.29 8.76,26.8 v8.64,26.92
  Bottom 0.203: IC1.12 8.92,25.62 8.64,25.91 v8.64,26.92
D4  (via drill 0.4)
  Top 0.254: J2.5 15.49,12.7 14.86,13.34 14.86,21.46 10.67,25.65 10.16,25.65 9.65,26.16 9.65,26.54 v9.45,26.75
  Bottom 0.203: 9.53,25.66 9.53,26.67 v9.45,26.75
  Bottom 0.254: 9.53,25.66 IC1.13
D5  (via drill 0.4)
  GND 0.203: J1.7 1.78,11.43 2.54,12.19 2.54,20.83 5.46,23.75 7.11,23.75 9.53,26.16 9.78,26.16 9.91,26.29 9.91,26.42 10.03,26.54 v10.03,27.43
  Bottom 0.203: IC1.14 10.06,26.14 9.96,26.24 9.96,26.47 10.01,26.52 10.01,26.7 10.13,26.82 10.13,27.33 v10.03,27.43
D6  (via drill 0.4)
  GND 0.203: J1.6 1.78,10.16 2.92,11.3 2.92,20.7 5.59,23.37 7.24,23.37 9.65,25.78 9.91,25.78 v10.54,26.42
  Bottom 0.203: IC1.15 10.56,26.4 v10.54,26.42
D7  (via drill 0.4)
  GND 0.203: J1.5 1.78,8.89 3.3,10.41 3.3,20.57 5.71,22.99 7.37,22.99 9.78,25.4 10.67,25.4 11.3,26.04 11.3,27.18 v10.16,28.32
  Bottom 0.203: IC1.16 11.06,26.04 11.18,26.24 11.18,26.67 10.67,27.18 10.67,27.81 v10.16,28.32
D8
  Bottom 0.254: J2.7 13.84,15.24 13.72,15.37 12.19,15.37 11.68,15.88 11.43,15.88 11.3,16 11.3,17.14 10.79,17.65 10.29,17.65 10.03,17.91 10.03,18.8 IC1.42
D9
  Bottom 0.254: IC1.43 9.56,17.62 10.03,17.14 10.54,17.14 10.79,16.89 10.79,15.75 11.18,15.37 11.43,15.37 11.94,14.86 13.59,14.86 14.61,13.84 15.62,13.84 J2.6
D10  (via drill 0.4)
  GND 0.203: J1.3 1.78,6.35 4.06,8.64 4.06,20.32 5.97,22.23 7.62,22.23 10.03,24.64 10.92,24.64 12.95,26.67 v13.84,26.67
  Bottom 0.203: IC1.22 14.06,26.46 v13.84,26.67
D10_SS  (via drill 0.4)
  Top 0.254: J5.1 5.46,4.19 7.37,6.1 v7.37,7.11 7.37,7.62 6.99,8 6.99,8.26 6.73,8.51 6.22,8.51 5.71,9.02 5.71,13.59 7.11,14.99 7.11,17.02 7.49,17.4 7.49,17.65 v7.87,18.03
  Bottom 0.254: IC1.44 8.16,18.82 7.87,18.54 v7.87,18.03 | IC2.32 7.5,6.97 v7.37,7.11
D11
  Bottom 0.254: IC1.23 15.49,25.27 15.88,25.27 J7.1
D11_MOSI  (via drill 0.4)
  Top 0.254: 7.37,19.56 v7.62,19.3 7.24,19.68 7.24,19.81 | 7.24,19.81 7.24,21.34 6.35,22.23 5.08,22.23 4.83,22.48 4.83,29.21 5.08,29.46 5.97,29.46 v6.48,28.7 | v5.21,6.73 5.21,6.99 4.19,8 4.19,18.03 5.84,19.68 6.35,19.68 6.48,19.81 7.24,19.81
  Bottom 0.203: IC2.35 6,6.06 5.71,6.35 5.59,6.35 v5.21,6.73
  Bottom 0.254: IC1.1 8.04,19.73 v7.62,19.3 | R5.2 v6.48,28.7
D12
  Bottom 0.254: J8.1 14.99,24.26 IC1.24
D12_MISO  (via drill 0.4)
  Top 0.254: v6.1,6.86 4.7,8.26 4.7,14.86 5.59,15.75 5.59,18.67 5.97,19.05 6.6,19.05 v6.99,18.8
  5V 0.254: J1.23 2.03,33.02 4.19,30.99 8.64,30.99 9.02,30.73 9.02,28.57 4.06,23.62 4.06,20.45 5.46,19.94 v6.99,18.8
  Bottom 0.203: v6.99,18.8 6.99,19.68 7.49,20.19 8.12,20.19
  Bottom 0.254: 8.12,20.19 IC1.2 | IC2.34 6.5,6.2 6.1,6.6 v6.1,6.86
D13_SCK  (via drill 0.4)
  Top 0.203: 6.6,17.91 7.11,18.03 7.62,18.67 7.87,18.67 8.26,19.05 8.26,19.56
  Top 0.254: v5.59,28.83 5.59,22.86 5.71,22.73 6.6,22.73 7.75,21.59 7.75,20.57 8.26,20.07 8.26,19.56 | v6.35,7.75 5.97,7.75 5.21,8.51 5.21,13.84 6.6,15.24 6.6,17.91 v6.22,18.41
  Bottom 0.203: IC1.3 7.52,20.73 6.22,19.43 v6.22,18.41
  Bottom 0.254: R6.2 v5.59,28.83 | IC2.33 7,6.46 6.73,6.73 6.73,7.37 v6.35,7.75
GND  (via drill 0.4, 0.7)
  Top 0.203: v12.06,21.08 12.06,19.18 11.68,18.8 | C1.- 13,1.73 v13.72,1.02 | 11.05,27.94 11.43,28.32 11.43,29.59 11.18,29.84 10.66,29.84 IC4.P$2 | v11.91,27.56 11.43,27.56
  Top 0.254: IC5.1 6.86,9.77 v6.99,9.65 | v13.72,1.02 13.06,1.78 C1.- | 10.19,12.47 10.19,12.67 v10.16,12.57 | 10.54,29.97 IC4.P$2 | 12.39,17.07 12.45,18.03 11.68,18.8
  Top 0.406: C4.2 9.78,30.73 IC4.P$2 11.2,30.69 C3.2 11.2,31.02 12.32,32.13 J3.1 | C5.2 10.19,12.47 C6.C 12.32,13.97 C42.2 12.39,14.37 12.39,17.07 12.2,17.27 C7.C | 14.86,27.56 14.99,27.56 v15.49,28.07 | C8.2 13.34,12.45 12.95,12.83 v12.95,13.46 | IC5.1 6.6,9.91 v6.6,10.92
  Top 0.61: 11.05,27.94 11.43,27.56 14.86,27.56 C2.C
  Top 0.813: J3.1 14.11,32.13 C17.1 | C6.C 12.57,14.1 v12.95,13.46
  GND 0.254: v5.33,1.52 5.33,3.56 8,6.22 8,7.87 v7.62,8.26 7.62,9.02 | v4.06,35.94 v4.06,34.04 4.32,34.04 5.08,33.27 8.38,33.27 9.27,32.38 9.27,31.24 | v10.41,21.21 10.16,20.95 8.26,20.95 7.24,19.94 5.84,19.3 4.95,17.91 v4.95,16.13 | 7.62,9.02 v6.99,9.65 | v6.73,12.83 6.73,11.05 v6.6,10.92 | v14.73,0.64 14.1,0.64 v13.72,1.02 | v15.88,2.92 v15.88,1.78 v15.88,0.64 | v9.75,8.71 7.7,9.09 7.62,9.02 | 1.27,22.07 1.11,22.07 | 0.38,21.59 0.38,4.32 1.14,3.81 J1.1 2.03,3.81 2.41,3.43 2.41,1.65 2.16,1.4 1.38,1.4 J1.GND_E
  GND 0.406: J1.16 1.75,23.34 J1.POE3 1.27,22.07 J1.15 | 9.27,31.24 IC4.P$2 | 1.11,22.07 0.38,21.59 | 6.73,11.05 7.62,11.05 v7.62,10.92
  Bottom 0.203: 9.4,16 9.4,15.21 9.47,15.14 9.47,14.26 | 14.2,12.67 13.49,12.04 12.74,12.04 | IC3.1 2.25,0.77 J1.GND_E | IC1.39 11.56,20.19 11.68,20.32 | v11.81,20.32 11.81,20.83 v12.06,21.08 | v13.72,1.02 13.72,1.3 C12.1 13.46,0.38 13.34,0.25 6.86,0.25 6.35,0.76 C11.1 | 12.06,27.53 12.06,25.63 IC1.18 | 12.06,27.53 C47.2 | 12.06,27.53 11.94,27.53 v11.91,27.56
  Bottom 0.254: C49.2 6.89,22.45 7.11,22.23 IC1.6 IC1.TGND | C14.1 3.68,25.78 3.17,25.27 3.17,24.64 | 3.17,24.64 3.17,19.05 3.81,18.41 C13.1 | 3.17,24.64 2.67,24.13 J1.16 | C41.2 R8.1 9.88,16.48 9.4,16 | 9.47,14.26 IC2.9 9.53,14.21 9.53,13.08 9.78,12.83 v10.16,12.57 | C43.2 14.2,12.67 14.35,12.83 | 12.74,12.04 IC2.14 | 13.08,9.53 | C48.2 15.8,22.23 IC1.28 IC1.TGND | 10.54,29.97 IC4.P$2 | IC1.18 12.06,22.73 IC1.TGND | IC1.TGND IC1.39 11.56,17.65 11.94,17.27 11.94,16.66 C50.2 | 6.5,13.05 IC2.3 6.5,15.75 C40.2 6.07,15.78 5.84,16 5.08,16 v4.95,16.13 | 6.5,13.05 v6.73,12.83 | C10.2 13.18,5.44 C9.2 13.31,5.97 14.1,5.97 J2.1 15.49,7.62 14.99,8.13 14.99,8.38 14.86,8.51 14.86,9.02 14.73,9.14 | 9.17,4.16 C46.2 9.01,4.1 IC2.29 9.02,6.22 8.64,6.6 8.51,6.6 8,7.11 8,7.49 7.62,7.87 v7.62,8.26 | IC2.19 13.08,9.53 | 14.38,9.27 C45.2 | IC3.1 4.32,1.78 4.7,1.78 4.92,1.55 C11.1 5.36,1.55 v5.33,1.52 | IC2.48 5.98,12.53 6.5,13.05 | C42.2 12.8,13.87 v12.95,13.46 13.59,13.46 14.22,12.83 C43.2 | C16.1 3.91,33.88 v4.06,34.04 | v4.06,35.94 3.58,35.94 C15.1 | v10.41,21.21 10.54,21.21 IC1.TGND | 13.08,9.53 13.53,9.53 13.95,9.12 C45.2 | 14.73,9.14 14.86,9.27 14.86,10.41 14.38,10.89 C44.2 14.09,11.03 IC2.16 14.24,11.03 14.35,10.92 14.73,10.92 14.86,11.05 14.86,12.32 14.73,12.45 14.45,12.45 C43.2 | 14.73,9.14 14.25,9.14 C45.2
  Bottom 0.61: v9.53,22.73 9.78,22.73 v10.41,22.1 v10.41,21.21 | 10.54,21.21 11.18,21.21 v11.3,21.34 | v11.81,20.32 11.68,20.32 v10.67,20.32 10.67,20.95 v10.41,21.21 | v9.53,21.46 10.16,21.46 v10.41,21.21 | v9.53,20.32 v10.41,21.21 | v14.73,0.64 v15.88,0.64 | v15.88,1.78 v15.88,2.92
  pour Top: 0,0 17.14,0 17.14,36.83 0,36.83
  pour GND: 0,0 17.14,0 17.14,36.83 0,36.83
  pour Bottom: 0,0 17.14,0 17.14,36.83 0,36.83
I2C_SCL
  Top 0.254: J3.4 9.78,34.67 8.76,33.66 4.7,33.66 2.79,31.75 J1.22
  Bottom 0.203: IC1.19 12.56,26.05 12.47,26.31 12.47,27.46 12.95,27.94 12.95,28.07 11.56,29.46 11.56,30.48
  Bottom 0.254: R3.1 4.57,31.24 4.06,31.75 J1.22 | 11.56,30.48 11.05,30.99 10.16,30.99 9.27,31.88 9.27,33.4 J3.4
I2C_SDA
  Top 0.254: J3.3 9.78,32.13 8.76,33.15 4.95,33.15 2.29,30.48 J1.21
  Bottom 0.203: IC1.20 13.06,26.08 12.93,26.21 12.93,26.24 12.88,26.34 12.88,27.23 13.46,27.81 13.46,28.19 12.06,29.59 12.06,30.61
  Bottom 0.254: J1.21 3.27,30.48 R4.1 | 12.06,30.61 J3.3
LINKLED  (via drill 0.4)
  Top 0.254: J1.8 1.91,12.7 2.03,12.57 2.41,12.57 2.67,12.32 2.67,3.81 3.68,2.79 5.59,2.79 v9.91,7.11
  Bottom 0.254: v9.91,7.11 10.16,6.86 10.54,6.86 11.05,6.35 11.05,5.37 IC2.25
MOSI
  Bottom 0.254: J1.25 2.29,35.56 2.92,34.92 3.53,34.92 C15.2 5.18,34.95 J3.8 6.73,33.4 6.73,31.62 6.6,31.5 R5.1
N$2
  Top 0.813: C17.2 14.11,34.67 J3.2 13.08,34.99 L1.1
N$3
  Bottom 0.254: IC2.36 J4.1
N$4
  Bottom 0.203: C14.2 4.92,26.13 5.21,26.42 6.43,26.42 6.55,26.29 6.55,25.93 R1.1 6.6,25.68 6.6,23.62 6.73,23.5 7.24,23.5 7.51,23.23 IC1.8
  Bottom 0.254: C14.2 4.92,24.48 Y1.1
N$5
  Bottom 0.203: Y1.2 4.7,22.61 5.08,22.99 6.22,22.99 6.27,23.04 | 6.27,23.04 7.11,23.04 7.44,22.71 8.14,22.71 IC1.7 | 5.87,25.63 6.1,25.4 6.1,23.22 6.27,23.04
  Bottom 0.254: R1.2 5.87,25.63 | Y1.2 4.7,19.56 5.21,19.05 5.21,18.51 C13.2
N$8
  Bottom 0.203: 15.23,21.73 15.44,21.73 15.72,21.44 15.75,21.46 15.75,21.21 J6.1
  Bottom 0.254: IC1.29 15.23,21.73
N$13  (via drill 0.4)
  Top 0.254: C8.1 13.34,9.91 | v10.74,8.56 11.61,8.56
  Top 0.406: C8.1 13.34,9.78 12.19,8.64 11.68,8.64 11.61,8.56
  Bottom 0.254: IC2.20 12.69,9.02 11.2,9.02 v10.74,8.56
N$18
  Bottom 0.254: IC2.22 11.84,8.03 11.56,7.75 11.56,6.76 C9.1
N$19
  Bottom 0.254: R8.2 10.01,15.49 IC2.10
RESET  (via drill 0.4)
  Top 0.254: v4.06,6.35 4.06,6.48 3.68,6.86 3.68,18.29 5.27,19.88 | 5.27,19.88 5.71,20.32 6.22,20.32 v6.48,20.57 | 5.27,19.88 5.27,20.77 4.32,21.72 4.32,24.74 v2.97,26.09
  Bottom 0.203: 8.14,21.21 7.49,21.21 6.99,20.7 6.6,20.7 v6.48,20.57
  Bottom 0.254: 8.14,21.21 IC1.4 | IC3.3 4.64,2.47 3.56,3.56 3.56,5.84 v4.06,6.35 | 4.32,27.21 4.32,26.67 4.19,26.54 3.43,26.54 v2.97,26.09 2.29,25.4 J1.17
  Bottom 0.406: 4.32,27.21 R7.1
RXIN
  Bottom 0.203: IC2.5 7.5,15 7.62,15.11 7.62,16.64 6.86,17.4 5.97,17.4 5.84,17.27 3.53,17.27
  Bottom 0.254: 3.53,17.27 3.53,17.3 1.78,19.05 J1.13
RXIP
  Bottom 0.203: IC2.6 8.01,14.99 8.13,15.11 8.13,16.76 7.11,17.78 5.71,17.78 5.59,17.65 3.94,17.65 2.67,18.92 2.67,19.4
  Bottom 0.254: J1.14 2.29,20.32 2.67,19.94 2.67,19.4
SCLK
  Bottom 0.254: J1.24 1.91,34.29 3.05,33.15 3.05,32.89 3.53,32.89 C16.2 4.67,32.92 J3.7 5.46,30.32 R6.1
TXON
  Bottom 0.254: IC2.1 2.76,14.23 2.76,14.26 2.67,14.35 2.67,14.48 1.91,15.24 J1.10
TXOP
  Bottom 0.254: IC2.2 6,15.08 5.71,15.37 2.89,15.37 2.89,15.39 2.79,15.49 2.79,15.75 2.03,16.51 J1.11
VIN
  Top 0.406: C4.1 8.7,30.73 IC4.P$1 7.97,29.75 D1.1
  5V 0.813: J1.2 2.67,5.08 3.05,5.46 3.05,23.88 8,28.83 8,29.97 IC4.P$1
WIZRST
  Bottom 0.203: IC2.37 2.92,6.14 2.92,2.87 IC3.2
XTLN
  Bottom 0.254: IC2.30 8.51,4.32 8.35,4.16 R2.2 8.35,3.58 9.4,2.54 11.3,2.54 Y2.2 12.8,2.51 C12.2
XTLP
  Bottom 0.203: IC2.31 8.01,4.55 R2.1
  Bottom 0.254: R2.1 7.39,2.77 7.75,2.41 Y2.1 7.01,2.51 C11.2

### Text on the board
_bsilk: SKAARDUINO v3.0 Back | SKAARHOJ 2015